# EasyEDA Pro project imu.eprj

# Schematic Schematic
Board Name: Board1; Create Date: 2025-12-13; Page Name: main; Project Name: imu; Schematic Name: Schematic; Update Date: 2026-01-16; Company: EasyEDA.com; Page Size: A4; Version: V1.0
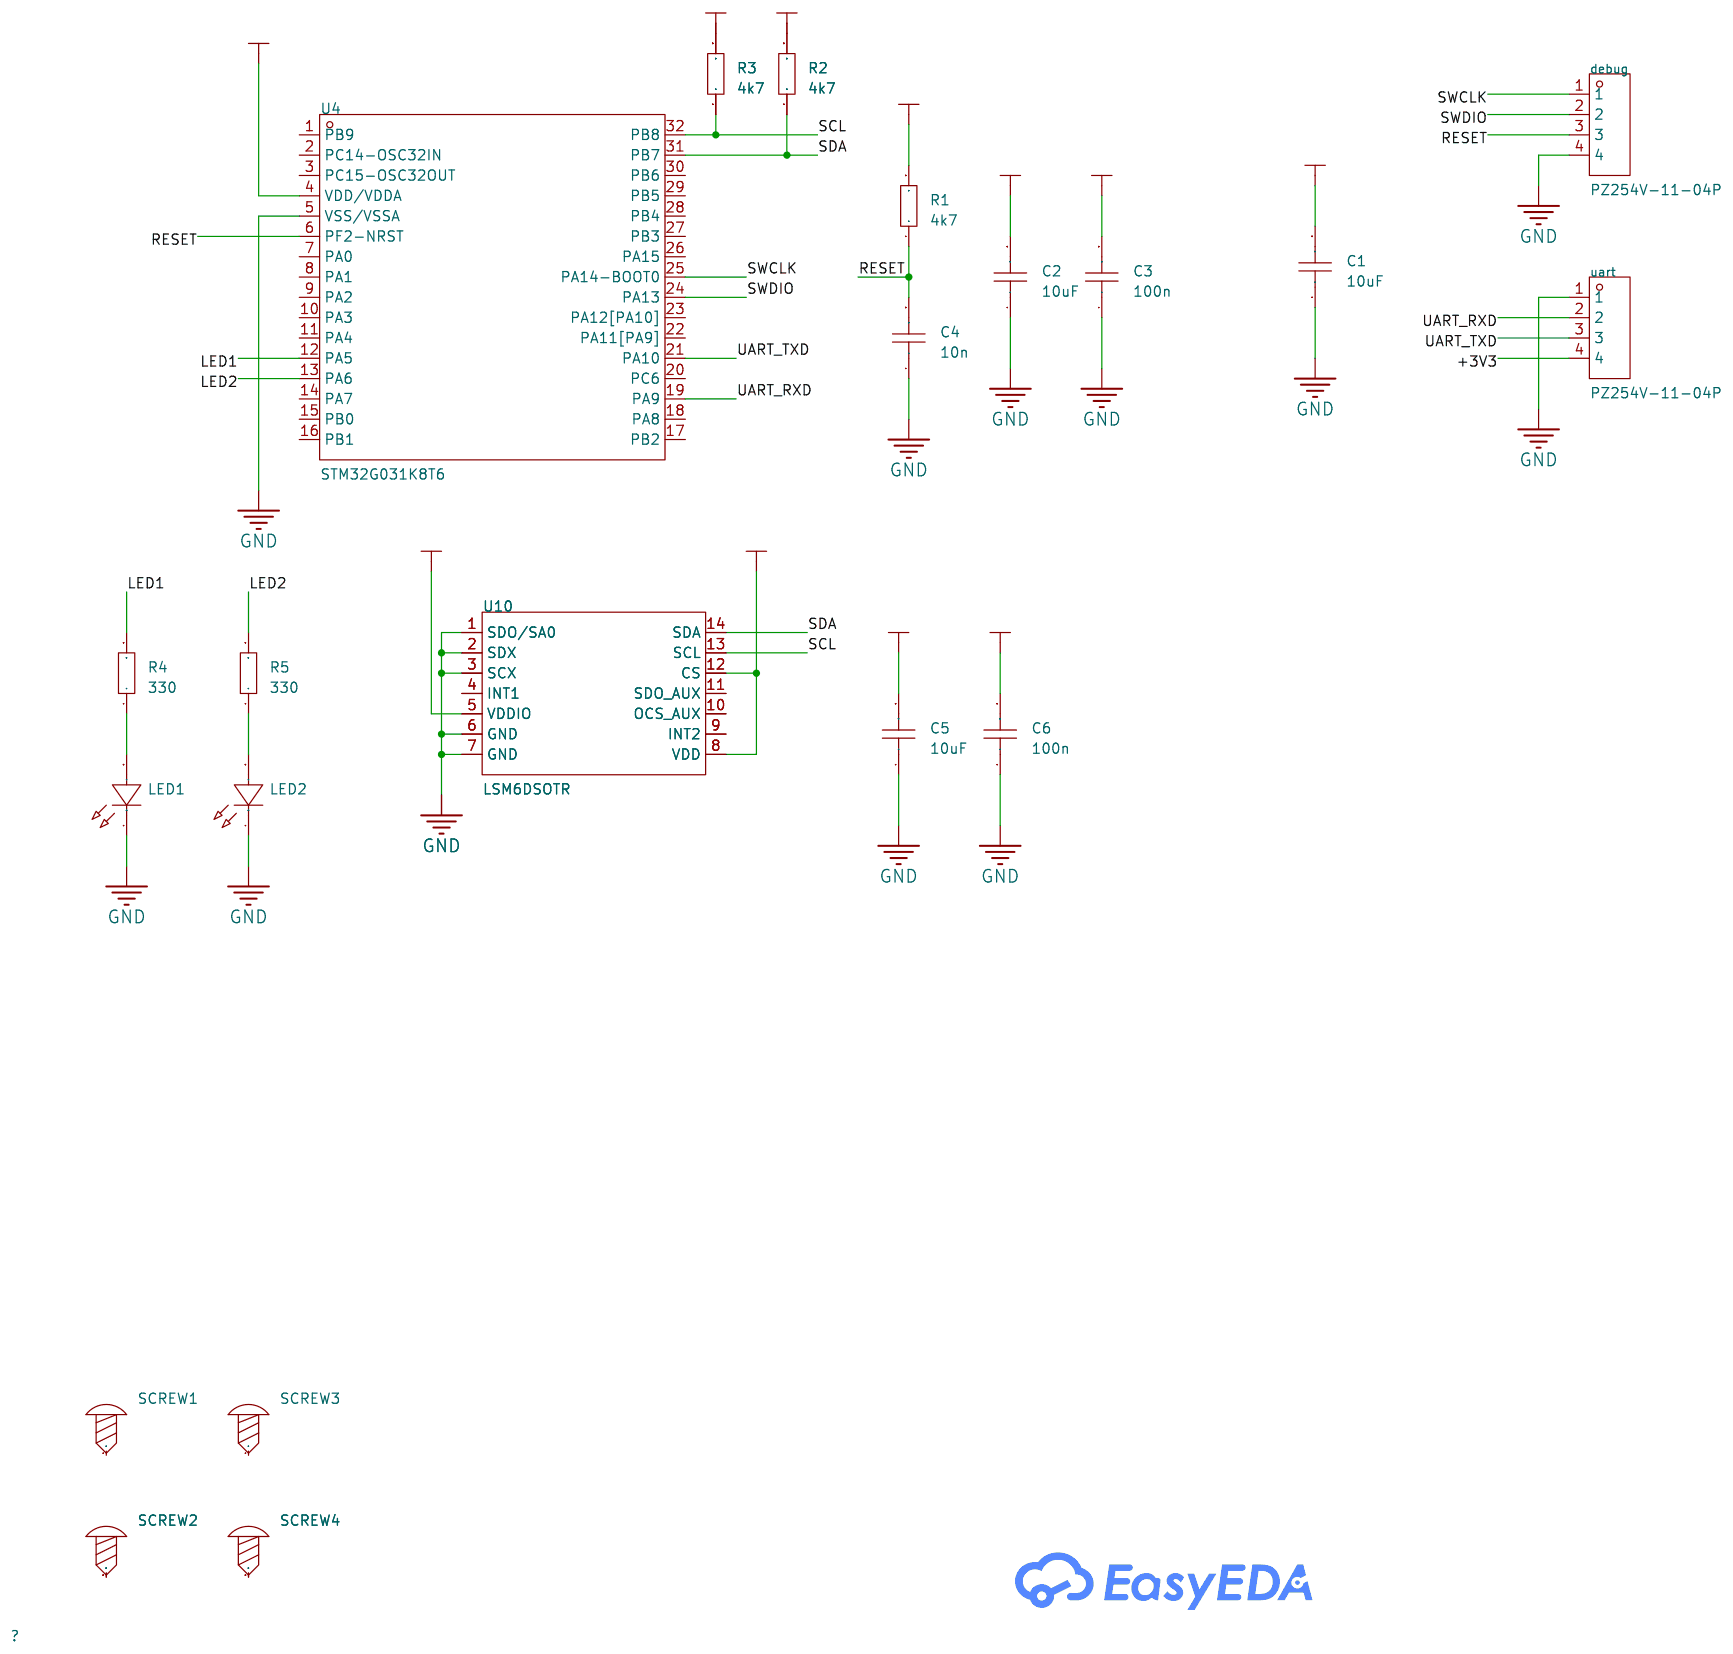
[diagram p0: schematic sheet]

## Parts
C1  10uF  [C0805]
C2  10uF  [C0805]
C3  10uF  [C0805]
C4  10uF  [C0805]
C5  10uF  [C0805]
C6  10uF  [C0805]
debug  PZ254V-11-04P  [HDR-TH_4P-P2.54-V-M]
LED1  P2-1206RTCS2-0.9T-F  [LED-SMD_L3.2-W1.6-P2-1206RTCS2-0.9T-F]
LED2  P2-1206RTCS2-0.9T-F  [LED-SMD_L3.2-W1.6-P2-1206RTCS2-0.9T-F]
R1  10kΩ  [R0805]
R2  10kΩ  [R0805]
R3  10kΩ  [R0805]
R4  10kΩ  [R0805]
R5  10kΩ  [R0805]
SCREW1  -  [Screw-Hole-M3]
SCREW2  -  [Screw-Hole-M3]
SCREW3  -  [Screw-Hole-M3]
SCREW4  -  [Screw-Hole-M3]
U4  STM32G031K8T6  [LQFP-32_L7.0-W7.0-P0.80-LS9.0-BL]
U10  LSM6DSOTR  [LGA-14_L3.0-W2.5-P0.50-TL]
uart  PZ254V-11-04P  [HDR-TH_4P-P2.54-V-M]

## Library data of the parts
C1-C6 = CL21A106KAYNNNE_C15850: Capacitance:10uF Tolerance:±10% Tolerance:±10% Voltage Rating:25V Temperature Coefficient:X5R; LCSC Part Name: 10uF ±10% 25V; Supplier Part: C15850; Manufacturer: SAMSUNG(三星); Manufacturer Part: CL21A106KAYNNNE; Supplier Footprint: 0805; JLCPCB Part Class: Basic Part; Datasheet: https://item.szlcsc.com/datasheet/CL21A106KAYNNNE/16532.html; Supplier: LCSC; Tolerance: ±10%; Voltage Rating: 25V; Temperature Coefficient: X5R
debug uart = PZ254V-11-04P: Pin Structure:1x4P Pitch:2.54mm Row Spacing:- Circluar Pins/Square Pins:Pin Header Mounting Type:Through Hole Number of Rows:1 Number of Pins:4P Current Rating:3A Voltage Rating (Max):250V Length of Mating Pin:6mm Insulation Height:2.5mm Length of End Con; LCSC Part Name: 1x4P 间距:2.54mm 方针 直插; Supplier Part: C2691448; Manufacturer: XFCN(兴飞); Supplier Footprint: 插件,P=2.54mm; JLCPCB Part Class: Extended Part; Datasheet: https://item.szlcsc.com/datasheet/PZ254V-11-04P/2801085.html; Supplier: LCSC; Pin Structure: 1x4P; Pitch: 2.54mm; Circluar Pins/Square Pins: Pin Header; Mounting Type: Through Hole; Number of Rows: 1; Number of Pins: 4P; Current Rating: 3A; Voltage Rating (Max): 250V; Length of Mating Pin: 6mm; Insulation Height: 2.5mm; Length of End Connection Pin: 3mm; Operating Temperature: -40℃~+105℃; Color: Black
LED1 LED2 = P2-1206RTCS2-0.9T-F: Illumination Color:Red Voltage - Forward(Vf):1.8V~2.4V Voltage - Forward(Vf):1.8V~2.4V Power(Watts):60mW Forward Current:20mA Wavelength - Dominant:618nm~625nm Wavelength - Dominant:618nm~625nm Peak Wavelength:630nm Diode Configuration:- Lens Color:Water; LCSC Part Name: 红灯 反贴; Supplier Part: C2827254; Manufacturer: TUOZHAN(拓展光电); Supplier Footprint: 1206; JLCPCB Part Class: Extended Part; Datasheet: https://item.szlcsc.com/datasheet/P2-1206RTCS2-0.9T-F/2972467.html; Supplier: LCSC; Illumination Color: Red; Voltage - Forward(Vf): 1.8V~2.4V; Power(Watts): 60mW; Forward Current: 20mA; Wavelength - Dominant: 618nm~625nm; Peak Wavelength: 630nm; Lens Color: Water Clear; Luminous Intensity: 250mcd; Viewing Angle: 120°; Mounting Style: Reverse Mount; Operating Temperature: -40℃~+85℃
R1-R5 = 0805W8F1002T5E: Type:Thick Film Resistor Resistance:10kΩ Tolerance:±1% Tolerance:±1% Power(Watts):125mW Voltage-Supply(Max):150V Temperature Coefficient:±100ppm/℃ Temperature Coefficient:±100ppm/℃ Operating Temperature:-55℃~+155℃ Operating Temperature:-55℃~+155℃; LCSC Part Name: 10kΩ ±1% 125mW 厚膜电阻; Supplier Part: C17414; Manufacturer: UNI-ROYAL(厚声); Supplier Footprint: 0805; JLCPCB Part Class: Basic Part; Datasheet: https://item.szlcsc.com/datasheet/0805W8F1002T5E/18102.html; Supplier: LCSC; Type: Thick Film Resistor; Tolerance: ±1%; Power(Watts): 125mW; Voltage-Supply(Max): 150V; Temperature Coefficient: ±100ppm/℃; Operating Temperature: -55℃~+155℃
SCREW1-SCREW4 = Screw-Hole-M3: Supplier Footprint: 插件
U4 = STM32G031K8T6: CPU Core:ARM Cortex-M Series CPU Maximum Speed:64MHz Program Storage Size:64KB Program Memory Type:FLASH Number of I/O:30 ADC (Bit):12bit Voltage - Supply:1.7V~3.6V Voltage - Supply:1.7V~3.6V Applications:-; LCSC Part Name: 主流Arm Cortex-M0+ MCU，具有64 KB Flash存储器、8 KB RAM、64 MHz CPU、2x USART、定时器、ADC和通信接口，1.7-3.6V; Supplier Part: C432203; Manufacturer: ST(意法半导体); Supplier Footprint: LQFP-32(7x7); JLCPCB Part Class: Extended Part; Datasheet: https://item.szlcsc.com/datasheet/STM32G031K8T6/428991.html; Supplier: LCSC; CPU Core: ARM Cortex-M Series; CPU Maximum Speed: 64MHz; Program Storage Size: 64KB; Program Memory Type: FLASH; Number of I/O: 30; ADC (Bit): 12bit; Voltage - Supply: 1.7V~3.6V
U10 = LSM6DSOTR: Supplier Part: C2655100; Manufacturer: ST(意法半导体); Supplier Footprint: LGA-14(2.5x3); JLCPCB Part Class: Extended Part; Datasheet: https://item.szlcsc.com/datasheet/LSM6DSOTR/2747009.html; Supplier: LCSC; Accelerometer Sensing Axis: X,Y,Z; Acceleration Measurement Range (MAX): ±16g; Gyroscope Sensing Axis: X,Y,Z; Gyroscope Measurement Range (MAX): ±2000dps; Sensor Type: Accelerometer Gyroscope; Interface: I2C；SPI; Voltage - Supply: 1.71V~3.6V; Cache Size: 9KB; Operating Temperature: -40℃~+85℃

## Nets
+3V3: C1.2 C2.2 C3.2 C5.2 C6.2 R1.2 R2.2 R3.2 U4.4(VDD/VDDA) U10.5(VDDIO) U10.8(VDD) U10.12(CS) uart.4
GND: C1.1 C2.1 C3.1 C4.1 C5.1 C6.1 debug.4 LED1.1(C) LED2.1(C) U4.5(VSS/VSSA) U10.1(SDO/SA0) U10.2(SDX) U10.3(SCX) U10.6(GND) U10.7(GND) uart.1
LED1: R4.2 U4.12(PA5)
LED2: R5.2 U4.13(PA6)
RESET: C4.2 debug.3 R1.1 U4.6(PF2-NRST)
SCL: R3.1 U4.32(PB8) U10.13(SCL)
SDA: R2.1 U4.31(PB7) U10.14(SDA)
SWCLK: debug.1 U4.25(PA14-BOOT0)
SWDIO: debug.2 U4.24(PA13)
UART_RXD: U4.19(PA9) uart.2
UART_TXD: U4.21(PA10) uart.3
$1N2138: LED1.2(A) R4.1
$1N2142: LED2.2(A) R5.1

Not connected (* = marked no-connect by the designer): SCREW1 1; SCREW2 1; SCREW3 1; SCREW4 1; U4 1(PB9) 2(PC14-OSC32IN) 3(PC15-OSC32OUT) 7(PA0) 8(PA1) 9(PA2) 10(PA3) 11(PA4) 14(PA7) 15(PB0) 16(PB1) 17(PB2) 18(PA8) 20(PC6) 22(PA11[PA9]) 23(PA12[PA10]) 26(PA15) 27(PB3) 28(PB4) 29(PB5) 30(PB6); U10 4(INT1) 9(INT2) 10(OCS_AUX) 11(SDO_AUX)

# Board PCB1
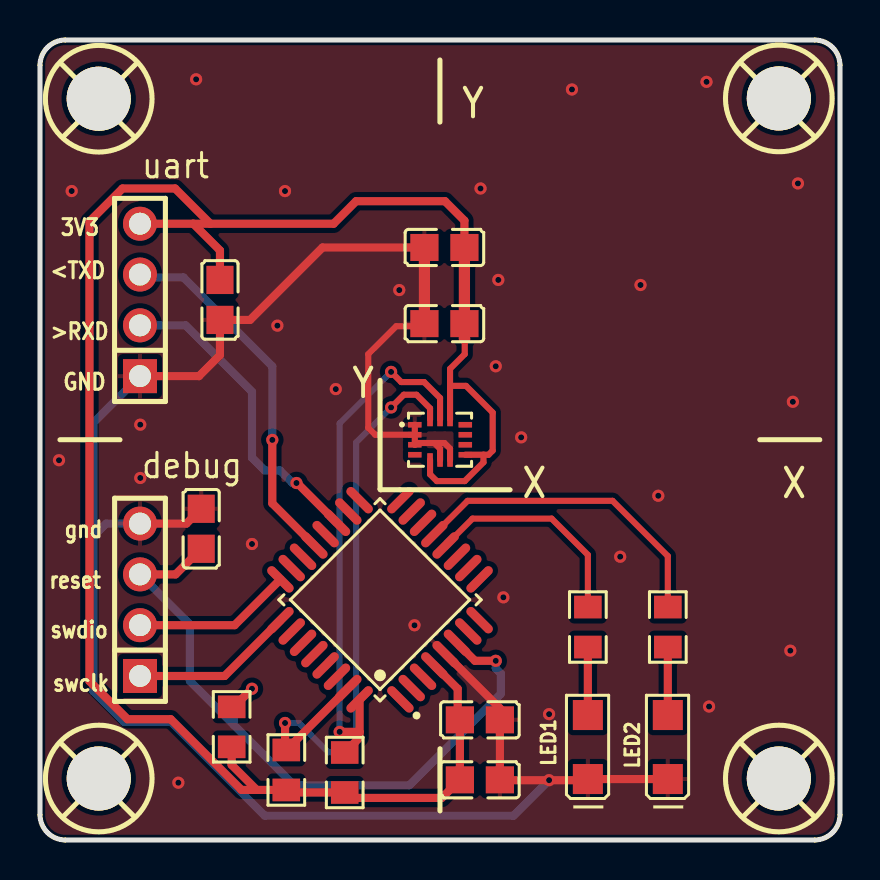
[diagram p1: board, top side]
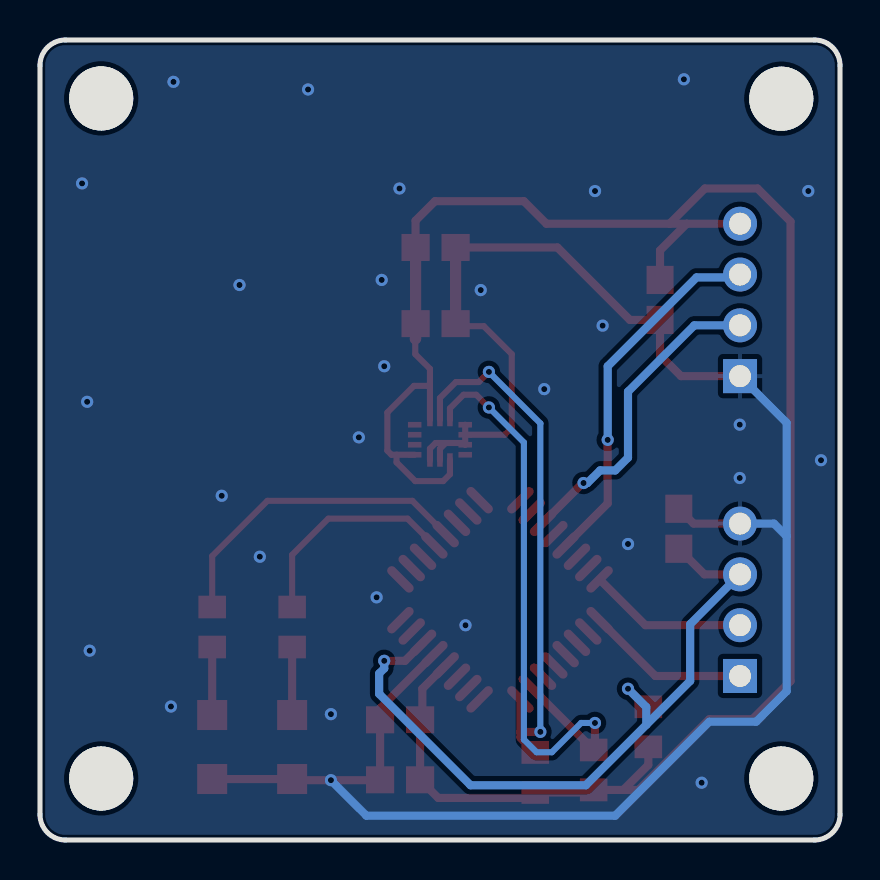
[diagram p2: board, bottom side, seen from below]

Outline 40 x 40 mm; copper layers: Top Layer, Bottom Layer. Coordinates in mm from the lower left corner of the outline.
Outline path: 0,38.73 0,1.27 arc(0.37,0.37) 1.27,0 38.73,0 arc(39.63,0.37) 40,1.27 40,38.73 arc(39.63,39.63) 38.73,40 1.27,40 arc(0.37,39.63) 0,38.73
Stack: Top Layer 0.035mm / Dielectric1 1.51mm FR4 er 4.5 / Bottom Layer 0.035mm

## Design rules (mm)
template: JLCPCB Capability(Two Layers Board)
spacing copperThickness1oz (default): track to track 0.102, other pairs 0.152 to 0.3
spacing copperThickness2oz: track to track 0.203, other pairs 0.152 to 0.3
track width copperThickness1oz (default): min 0.127, default 0.254, max 2.54
track width copperThickness2oz: min 0.203, default 0.254, max 2.54
differential pair differentialPair (default): width min 0.127, default 0.254, max 2.54; gap min 0.152, default 0.152
via viaSize (default): diameter min 0.5, default 0.61, max 10; hole min 0.3, default 0.305, max 6.3

## Placement (name value [footprint] x y rotation side)
C1  10uF  [C0805]  9 27 90 top
C2  10uF  [C0805]  21.99 3.01 180 top
C3  10uF  [C0805]  21.99 6.01 180 top
C4  10uF  [C0805]  8.06 15.56 270 top
C5  10uF  [C0805]  20.22 25.82 0 top
C6  10uF  [C0805]  20.22 29.63 0 top
debug  PZ254V-11-04P  [HDR-TH_4P-P2.54-V-M]  5 12.01 90 top
LED1  P2-1206RTCS2-0.9T-F  [LED-SMD_L3.2-W1.6-P2-1206RTCS2-0.9T-F]  27.39 4.65 90 top
LED2  P2-1206RTCS2-0.9T-F  [LED-SMD_L3.2-W1.6-P2-1206RTCS2-0.9T-F]  31.39 4.65 90 top
R1  10kΩ  [R0805]  9.58 5.66 270 top
R2  10kΩ  [R0805]  12.32 3.5 270 top
R3  10kΩ  [R0805]  15.24 3.38 270 top
R4  10kΩ  [R0805]  27.39 10.65 90 top
R5  10kΩ  [R0805]  31.39 10.65 90 top
SCREW1  -  [Screw-Hole-M3]  3 3.01 0 top
SCREW2  -  [Screw-Hole-M3]  37 3.01 0 top
SCREW3  -  [Screw-Hole-M3]  3 37 0 top
SCREW4  -  [Screw-Hole-M3]  37 37.01 0 top
U4  STM32G031K8T6  [LQFP-32_L7.0-W7.0-P0.80-LS9.0-BL]  17 12.01 45 top
U10  LSM6DSOTR  [LGA-14_L3.0-W2.5-P0.50-TL]  20 20.01 0 top
uart  PZ254V-11-04P  [HDR-TH_4P-P2.54-V-M]  5 27 90 top

## Footprints (pads in the part's own frame, mm; a bottom-side part is the same pattern mirrored in y, then rotated)
C0805
  rect 1.41x1.35 smd: 1(-1,0) 2(1,0)
HDR-TH_4P-P2.54-V-M
  rect 1.7x1.7 hole 1.1: 1(-3.81,0)
  round 1.7 hole 1.1: 2(-1.27,0) 3(1.27,0) 4(3.81,0)
LED-SMD_L3.2-W1.6-P2-1206RTCS2-0.9T-F
  rect 1.5x1.5 smd: 1(-1.6,0) 2(1.6,0)
LGA-14_L3.0-W2.5-P0.50-TL
  rect 0.675x0.28 smd: 1(-1.262,0.75) 2(-1.262,0.25) 3(-1.262,-0.25) 4(-1.262,-0.75) 8(1.262,-0.75) 9(1.262,-0.25) 10(1.262,0.25) 11(1.262,0.75)
  rect 0.28x0.675 smd: 5(-0.5,-1.012) 6(0,-1.012) 7(0.5,-1.012) 12(0.5,1.012) 13(0,1.012) 14(-0.5,1.012)
LQFP-32_L7.0-W7.0-P0.80-LS9.0-BL
  oval 0.448x1.684 smd: 1(-2.8,-4.242) 2(-2,-4.242) 3(-1.2,-4.242) 4(-0.4,-4.242) 5(0.4,-4.242) 6(1.2,-4.242) 7(2,-4.242) 8(2.8,-4.242) 17(2.8,4.242) 18(2,4.242) 19(1.2,4.242) 20(0.4,4.242) 21(-0.4,4.242) 22(-1.2,4.242) 23(-2,4.242) 24(-2.8,4.242)
  oval 1.684x0.448 smd: 9(4.242,-2.8) 10(4.242,-2) 11(4.242,-1.2) 12(4.242,-0.4) 13(4.242,0.4) 14(4.242,1.2) 15(4.242,2) 16(4.242,2.8) 25(-4.242,2.8) 26(-4.242,2) 27(-4.242,1.2) 28(-4.242,0.4) 29(-4.242,-0.4) 30(-4.242,-1.2) 31(-4.242,-2) 32(-4.242,-2.8)
R0805
  rect 1.133x1.377 smd: 1(-1,0) 2(1,0)
Screw-Hole-M3
  round 3.2 hole 3.2: 1(-0.064,0.064)

## Nets
As in the schematic.

Pads without a net: SCREW1 1; SCREW2 1; SCREW3 1; SCREW4 1; U4 1 2 3 7 8 9 10 11 14 15 16 17 18 20 22 23 26 27 28 29 30; U10 4 9 10 11

## Via types
v1: diameter 0.61, hole 0.305, Top Layer to Bottom Layer, 36 vias

## Routing (per net, layer and track width the routed paths; a pad name or vN(x,y) marks a point on that pad's centre or on a via; arc(x,y) is an arc through that point)
+3V3: length 101.7
  Top Layer w0.305: U10.8 22.17,19.26 ; 22.17,19.26 22.43,19.26 22.63,19.47 22.63,21.37 21.3,22.71 20.5,22.71 ; 22.17,19.26 22.17,18.88 21.24,17.95 19.84,17.95 19.5,18.28 19.5,19 ; U10.12 20.5,22.71 ; 20.5,22.71 20.5,23.56 21.24,24.29 21.24,25.06
  Top Layer w0.406: 10.83,2.5 10.07,2.5 6.54,6.04 4.38,6.04 2.47,7.94 2.47,30.92 4.12,32.57 6.76,32.57 8.52,30.81 ; 10.83,2.5 9.58,3.75 R1.2 ; 10.83,2.5 R2.2 12.44,2.38 R3.2 15.51,2.1 20.09,2.1 C2.2 C3.2 20.88,6.12 20.88,7.56 U4.4 ; C1.2 9,29.48 7.66,30.81 ; 8.52,30.81 14.68,30.81 15.81,31.94 20.25,31.94 21.22,30.97 C6.2 ; 8.52,30.81 7.66,30.81 ; uart.4 7.66,30.81
  Top Layer w0.559: C6.2 C5.2 21.22,25.07 21.24,25.06
GND: length 100.4
  Top Layer w0.305: 19.71,19.85 18.83,19.85 U10.3 U10.2 ; 19.71,19.85 20.22,19.85 20.5,19.57 20.5,19 ; 19.71,19.85 20,19.56 20,19 ; U10.2 U10.1 ; U10.2 16.76,20.26 16.41,20.61 16.41,24.29 17.81,25.69 19.09,25.69 C5.1
  Top Layer w0.406: C4.1 7.32,15.82 debug.4 ; LED2.1 LED1.1 27.34,2.99 v1(25.45,2.99) 23.01,2.99 C2.1 C3.1 22.99,6.58 U4.5 ; uart.1 7.95,23.19 9,24.24 C1.1 10.5,26 14.13,29.63 C6.1
  Top Layer w0.559: C5.1 C6.1
  Bottom Layer w0.406: 2.67,15.18 2.67,20.86 uart.1 ; 2.67,15.18 2.67,7.44 4.19,5.91 6.54,5.91 11.24,1.21 23.68,1.21 v1(25.45,2.99) ; 2.67,15.18 3.3,15.82 debug.4
  vias: v1(0.95,18.99) v1(1.58,32.45) v1(5.01,20.77) v1(5.01,18.1) v1(6.92,2.86) v1(7.81,38.03) v1(10.6,14.8) v1(11.87,25.72) v1(12.25,32.45) v1(14.79,22.54) v1(17.96,27.5) v1(18.73,10.74) v1(22.03,32.57) v1(22.79,23.69) v1(22.92,28) v1(23.17,12.13) v1(24.06,20.13) v1(25.45,6.29) v1(26.6,37.53) v1(29.01,14.16) v1(30.03,27.75) v1(30.91,17.21) v1(33.33,37.91) v1(33.45,6.67) v1(37.52,9.47) v1(37.64,21.91) v1(37.9,32.83)
LED1: length 11
  Top Layer w0.305: R4.2 27.39,14.26 25.58,16.07 21.62,16.07 20.28,14.73
LED2: length 16.1
  Top Layer w0.305: R5.2 31.39,14.2 28.63,16.96 21.38,16.96 U4.13
RESET: length 37.2
  Top Layer w0.406: R1.1 9.69,6.66 v1(10.6,7.56) ; debug.3 6.78,13.28 C4.2 ; 20.85,9.86 21.75,8.96 v1(22.79,8.96)
  Bottom Layer w0.406: v1(22.79,8.96) 22.79,8.58 23.04,8.32 23.04,7.31 18.47,2.74 12.71,2.74 9.69,5.76 ; debug.3 7.49,10.79 7.49,7.95 9.69,5.76 ; 9.69,5.76 9.69,6.65 v1(10.6,7.56)
SCL: length 27.1
  Top Layer w0.305: v1(17.55,23.41) 18.06,22.9 19.21,22.9 20,22.1 U10.13
  Top Layer w0.406: R3.1 15.98,5.12 U4.32 ; v1(14.98,5.41) 15.98,5.41
  Bottom Layer w0.305: v1(17.55,23.41) 14.98,20.83 v1(14.98,5.41)
SDA: length 30.6
  Top Layer w0.305: U10.14 19.5,21.58 18.82,22.26 18.19,22.26 v1(17.55,21.63)
  Top Layer w0.406: v1(12.25,5.85) 12.25,4.57 R2.1 15.41,7.6 U4.31
  Bottom Layer w0.305: v1(12.25,5.85) 12.95,5.85 14.41,4.39 15.17,4.39 15.81,5.02 15.81,19.88 v1(17.55,21.63)
SWCLK: length 8.2
  Top Layer w0.406: U4.25 9.23,8.2 debug.1
SWDIO: length 8
  Top Layer w0.406: debug.2 9.73,10.74 U4.24
UART_RXD: length 15.9
  Top Layer w0.406: U4.19 12.86,17.85 v1(12.82,17.85)
  Bottom Layer w0.406: v1(12.82,17.85) 12.63,17.85 12,18.48 11.23,18.48 10.6,19.12 10.6,22.42 7.28,25.73 uart.2
UART_TXD: length 18.3
  Top Layer w0.406: v1(11.62,20) 11.62,16.83 13.72,14.73
  Bottom Layer w0.406: v1(11.62,20) 11.62,23.69 7.17,28.13 5.14,28.13 uart.3
$1N2138: length 3.4
  Top Layer w0.406: LED1.2 R4.1
$1N2142: length 3.4
  Top Layer w0.406: LED2.2 R5.1

## Copper pours and planes (outline as drawn; the poured copper is in the pictures)
GND on Top Layer: -2.48,42.22 43.36,42.22 43.36,-1.07 -2.48,-1.07
GND on Bottom Layer: -5.53,45.91 57.83,45.91 57.83,-3.36 -5.53,-3.36

## Text on the board
Top Silkscreen Layer: reset | swdio | <TXD | >RXD | swclk | 3V3 | GND | gnd | Y | X
